# EAGLE design Controller (EAGLE 8.6.0)
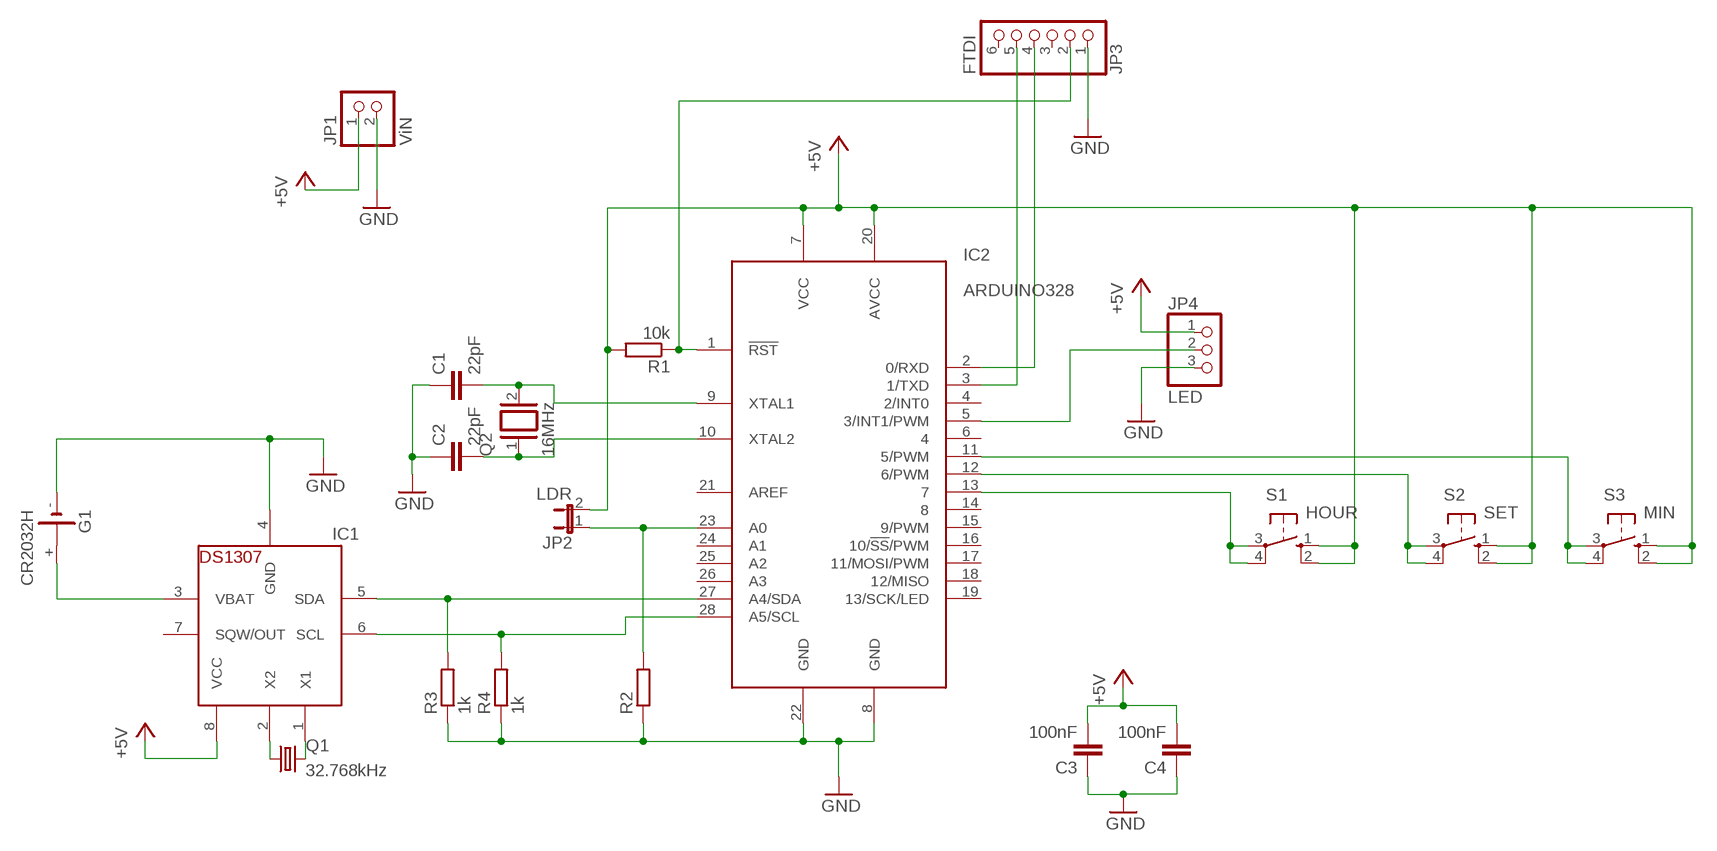
[diagram p0: schematic, sheet 1]

## Parts
C1  22pF  C-EU025-024X044  [C025-024X044]
C2  22pF  C-EU025-024X044  [C025-024X044]
C3  100nF  C-EU025-024X044  [C025-024X044]
C4  100nF  C-EU025-024X044  [C025-024X044]
G1  CR2032H  [CR2032H]
IC1  DS1307  [DIL08]
IC2  ARDUINO328  [DIP28]
JP1  ViN  PINHD-1X2  [1X02]
JP2  LDR  JP1E  [JP1]
JP3  FTDI  PINHD-1X6  [1X06]
JP4  LED  PINHD-1X3  [1X03]
Q1  32.768kHz  CRYSTALTC26V  [TC26V]
Q2  16MHz  XTAL/S  [QS]
R1  10k  R-EU_0204/5  [0204/5]
R2  R-EU_0204/5  [0204/5]
R3  1k  R-EU_0204/5  [0204/5]
R4  1k  R-EU_0204/5  [0204/5]
S1  HOUR  10-XX  [B3F-10XX]
S2  SET  10-XX  [B3F-10XX]
S3  MIN  10-XX  [B3F-10XX]

## Nets
+5V: C3.2 C4.2 IC1.8(VCC) IC2.7(VCC) IC2.20(AVCC) JP1.1 JP2.2 JP4.1 R1.2 S1.1(S) S1.2(S1) S2.1(S) S2.2(S1) S3.1(S) S3.2(S1)
GND: C1.1 C2.1 C3.1 C4.1 G1.- IC1.4(GND) IC2.8(GND) IC2.22(GND) JP1.2 JP3.1 JP4.3 R2.1 R3.1 R4.1
N$1: C1.2 IC2.9(XTAL1) Q2.2
N$2: C2.2 IC2.10(XTAL2) Q2.1
N$3: IC2.1(!RST) JP3.2 R1.1
N$4: IC1.5(SDA) IC2.27(A4/SDA) R3.2
N$5: IC1.6(SCL) IC2.28(A5/SCL) R4.2
N$6: IC2.23(A0) JP2.1 R2.2
N$7: IC1.2(X2) Q1.1
N$8: IC1.1(X1) Q1.2
N$9: IC2.11(5/PWM) S3.3(P) S3.4(P1)
N$10: IC2.12(6/PWM) S2.3(P) S2.4(P1)
N$11: IC2.13 S1.3(P) S1.4(P1)
N$12: IC2.2(0/RXD) JP3.4
N$13: IC2.3(1/TXD) JP3.5
N$15: IC2.5(3/INT1/PWM) JP4.2
VBAT: G1.+ IC1.3(VBAT)
Unconnected: G1.+@1(+) IC1.7(SQW/OUT) IC2.4(2/INT0) IC2.6 IC2.14 IC2.15(9/PWM) IC2.16(10/!SS!/PWM) IC2.17(11/MOSI/PWM) IC2.18(12/MISO) IC2.19(13/SCK/LED) IC2.21(AREF) IC2.24(A1) IC2.25(A2) IC2.26(A3) JP3.3 JP3.6

## Library data of the parts
C1-C4 = rcl:C-EU: CAPACITOR, European symbol; SPICEPREFIX: C
G1 = battery:CR2032H: LI BATTERY Varta
IC1 = adafruit:DS1307: DS1307 Real time clock (RTC) with battery backup ability. Talk to it via i2c
IC2 = ArduinoChip:ARDUINO328: PDIP ATMEGA328 with pins marked as reference in the Arudino IDE
JP1 = pinhead:PINHD-1X2: PIN HEADER
JP2 = jumper:JP1E: JUMPER
JP3 = pinhead:PINHD-1X6: PIN HEADER
JP4 = pinhead:PINHD-1X3: PIN HEADER
Q1 = crystal:CRYSTAL: CRYSTAL; OC_FARNELL: unknown; OC_NEWARK: unknown
Q2 = special:XTAL/S: CRYSTAL
R1-R4 = resistor:R-EU_: RESISTOR, European symbol
S1-S3 = switch-omron:10-XX: OMRON SWITCH; MPN: B3F-1000; OC_FARNELL: 176432; OC_NEWARK: 36M3542

## Board
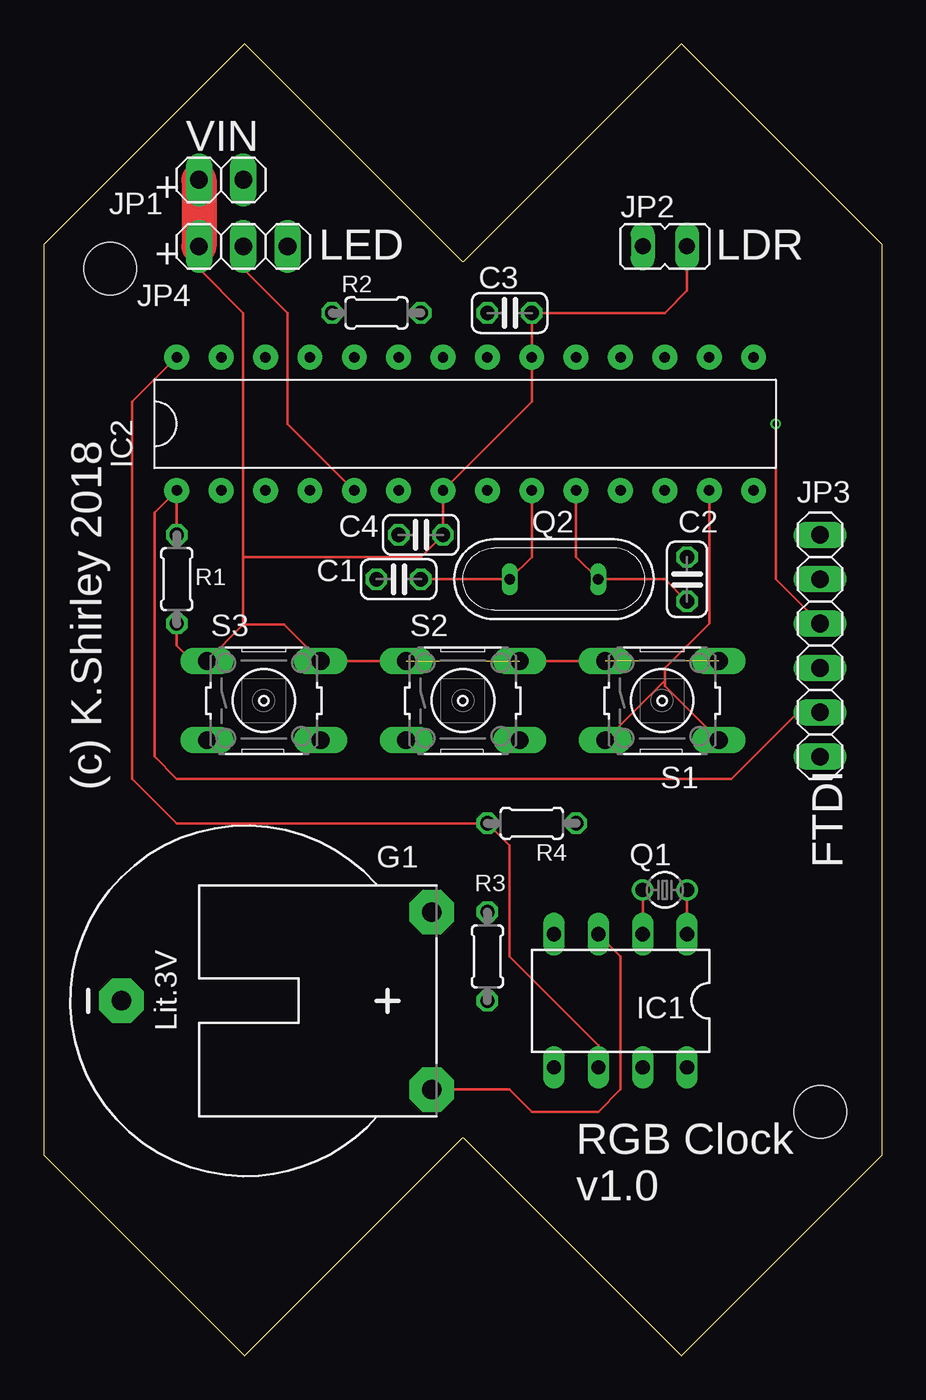
[diagram p1: board, top side]
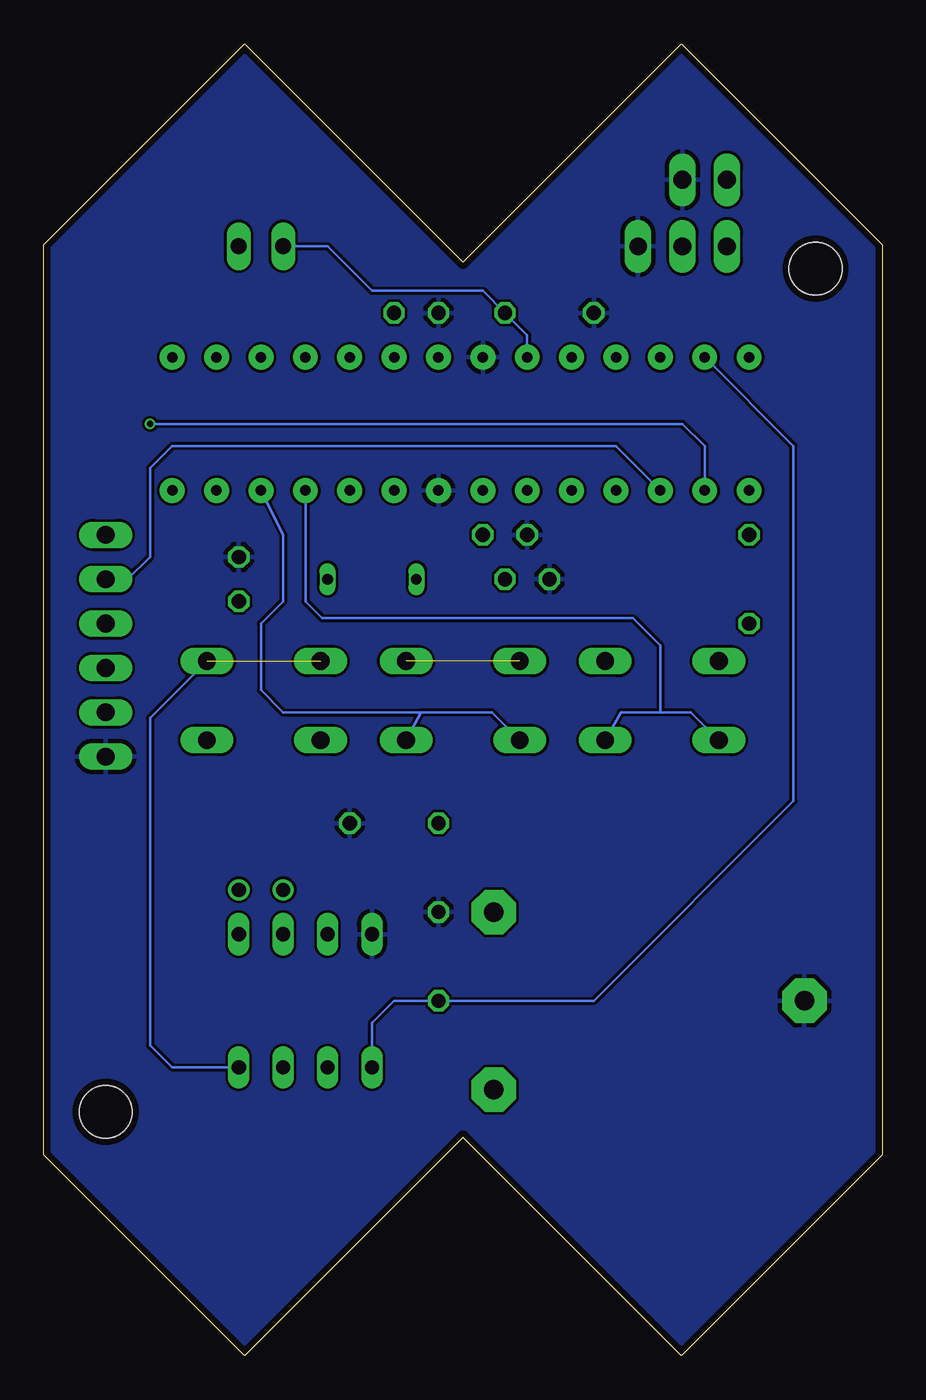
[diagram p2: board, bottom side, seen from below]

Size 48 x 75.1 mm. Coordinates in mm from the lower left corner, seen from the top.
Outline: 0,11.5 11.5,0 24,12.5 36.5,0 48,11.5 48,63.6 36.5,75.1 24,62.6 11.5,75.1 0,63.6 0,11.5
Copper layers (1*16): Top 0.035559375mm / dielectric 1.6mm / Bottom 0.035559375mm
Design rules "oshpark-2layer": minimum track width 6mil, minimum drill 10mil, track to track 6mil, track to pad 6mil, pad to pad 6mil, via to via 6mil, smd to smd 6mil, copper to edge 15mil, drill to drill 6mil, minimum pad ring 5mil, minimum via ring 5mil, stop-mask expansion 2.5mil, vias tented up to drill 0mil, thermal gap 10mil
Holes 3 mm at 3.81,62.23 44.45,13.97

### Footprints (pad centres in the part's own frame; a part is rotated, then mirrored left to right if it is on the bottom)
C025-024X044 = drill 0.813 octagon: 1 -1.27,0; 2 1.27,0
CR2032H = drill 1.118 pad 2.54 octagon: + 5.08,10.795; +@1 -5.08,10.795; - 0,-6.985
DIL08 = drill 0.813 long: 1 -3.81,-3.81; 2 -1.27,-3.81; 3 1.27,-3.81; 4 3.81,-3.81; 5 3.81,3.81; 6 1.27,3.81; 7 -1.27,3.81; 8 -3.81,3.81
DIP28 = drill 0.6 pad 1.422: 1 -3.81,16.51; 2 -3.81,13.97; 3 -3.81,11.43; 4 -3.81,8.89; 5 -3.81,6.35; 6 -3.81,3.81; 7 -3.81,1.27; 8 -3.81,-1.27; 9 -3.81,-3.81; 10 -3.81,-6.35; 11 -3.81,-8.89; 12 -3.81,-11.43; 13 -3.81,-13.97; 14 -3.81,-16.51; 15 3.81,-16.51; 16 3.81,-13.97; 17 3.81,-11.43; 18 3.81,-8.89; 19 3.81,-6.35; 20 3.81,-3.81; 21 3.81,-1.27; 22 3.81,1.27; 23 3.81,3.81; 24 3.81,6.35; 25 3.81,8.89; 26 3.81,11.43; 27 3.81,13.97; 28 3.81,16.51
1X02 = drill 1.016 long: 1 -1.27,0; 2 1.27,0
JP1 = drill 0.914 long: 1 0,-1.27; 2 0,1.27
1X06 = drill 1.016 long: 1 -6.35,0; 2 -3.81,0; 3 -1.27,0; 4 1.27,0; 5 3.81,0; 6 6.35,0
1X03 = drill 1.016 long: 1 -2.54,0; 2 0,0; 3 2.54,0
TC26V = drill 0.813: 1 -1.27,0; 2 1.27,0
QS = drill 0.61 long: 1 -2.54,0; 2 2.54,0
0204/5 = drill 0.813 octagon: 1 -2.54,0; 2 2.54,0
B3F-10XX = drill 1.016 long: 1 -3.251,2.261; 2 3.251,2.261; 3 -3.251,-2.261; 4 3.251,-2.261

### Placement (x,y rotation side)
C1  20.32,44.45 0 top
C2  36.83,44.45 270 top
C3  26.67,59.69 0 top
C4  21.59,46.99 0 top
G1  11.43,20.32 270 top
IC1  33.02,20.32 180 top
IC2  24.13,53.34 90 top
JP1  10.16,67.31 0 top
JP2  35.56,63.5 270 top
JP3  44.45,40.64 90 top
JP4  11.43,63.5 0 top
Q1  35.56,26.67 0 top
Q2  29.21,44.45 180 top
R1  7.62,44.45 270 top
R2  19.05,59.69 0 top
R3  25.4,22.86 270 top
R4  27.94,30.48 180 top
S1  35.4,37.5 0 top
S2  24,37.5 0 top
S3  12.6,37.5 0 top

### Tracks (layer width: path | path; a pad name or v marks a point on that pad's centre or on a via)
+5V  (2 unrouted)
  Top 0.152: JP2.2 36.83,60.96 35.56,59.69 C3.2 IC2.20 27.94,54.61 IC2.7 C4.2 21.59,45.72 11.43,45.72 | JP4.1 8.89,62.23 11.43,59.69 11.43,45.72 | 11.43,41.84 S3.1 8.5,39.76 7.62,40.64 R1.2 | 11.43,41.84 11.43,45.72 | S2.1 S3.2 13.77,41.84 11.43,41.84 | S2.2 S1.1
  Top 2: JP1.1 JP4.1
  Bottom 0.152: S1.2 41.91,36.5 41.91,17.78 40.64,16.51 IC1.8
GND
  pour Bottom: -1.27,78.74 34.29,78.74 49.53,63.5 49.53,11.43 36.83,-1.27 11.43,-1.27 -1.27,11.43
N$1
  Top 0.152: IC2.9 27.94,45.72 Q2.2 C1.2
N$2
  Top 0.152: IC2.10 30.48,45.72 Q2.1 35.56,44.45 C2.2
N$3
  Top 0.152: R1.1 IC2.1 6.35,48.26 6.35,34.29 7.62,33.02 39.37,33.02 43.18,36.83 JP3.2
N$4
  Bottom 0.152: IC1.5 29.21,19.05 27.94,20.32 R3.2 16.51,20.32 5.08,31.75 5.08,52.07 IC2.27
N$5
  Top 0.152: IC1.6 31.75,17.78 26.67,22.86 26.67,29.21 R4.2 7.62,30.48 5.08,33.02 5.08,54.61 IC2.28
N$6
  Bottom 0.152: IC2.23 20.32,58.42 R2.2 22.86,60.96 29.21,60.96 31.75,63.5 JP2.1
N$7
  Top 0.152: Q1.1 IC1.2
N$8
  Top 0.152: Q1.2 IC1.1
N$9
  Bottom 0.152: IC2.11 33.02,43.18 32.05,42.22 14.28,42.22 12.7,40.64 12.7,36.83 | 12.7,36.83 14.96,36.83 S3.4 | S3.3 10.94,36.83 12.7,36.83
N$10
  Bottom 0.152: IC2.12 34.29,46.99 34.29,43.18 35.56,41.91 35.56,38.1 34.29,36.83 26.39,36.83 | 26.39,36.83 S2.4 | S2.3 22.34,36.83 26.39,36.83
N$11
  Top 0.152: 35.56,38.65 35.56,39.37 38.1,41.91 IC2.13 | S1.3 35.56,38.65 | S1.4 35.56,38.33 35.56,38.65
N$12  (via drill 0.35)
  Top 0.152: v41.91,53.34 41.91,44.45 JP3.4
  Bottom 0.152: IC2.2 10.16,52.07 11.43,53.34 v41.91,53.34
N$13
  Bottom 0.152: IC2.3 15.24,52.07 40.64,52.07 41.91,50.8 41.91,45.72 43.18,44.45 JP3.5
N$15
  Top 0.152: JP4.2 11.43,62.23 13.97,59.69 13.97,53.34 IC2.5
VBAT
  Top 0.152: G1.+ 26.67,15.24 27.94,13.97 31.75,13.97 33.02,15.24 33.02,22.86 IC1.3

### Text on the board
tNames: VIN | + | LED | LDR | + | (c) K.Shirley 2018 | FTDI | RGB Clock / v1.0